# EAGLE design atmega328p robot (EAGLE 8.4.3)
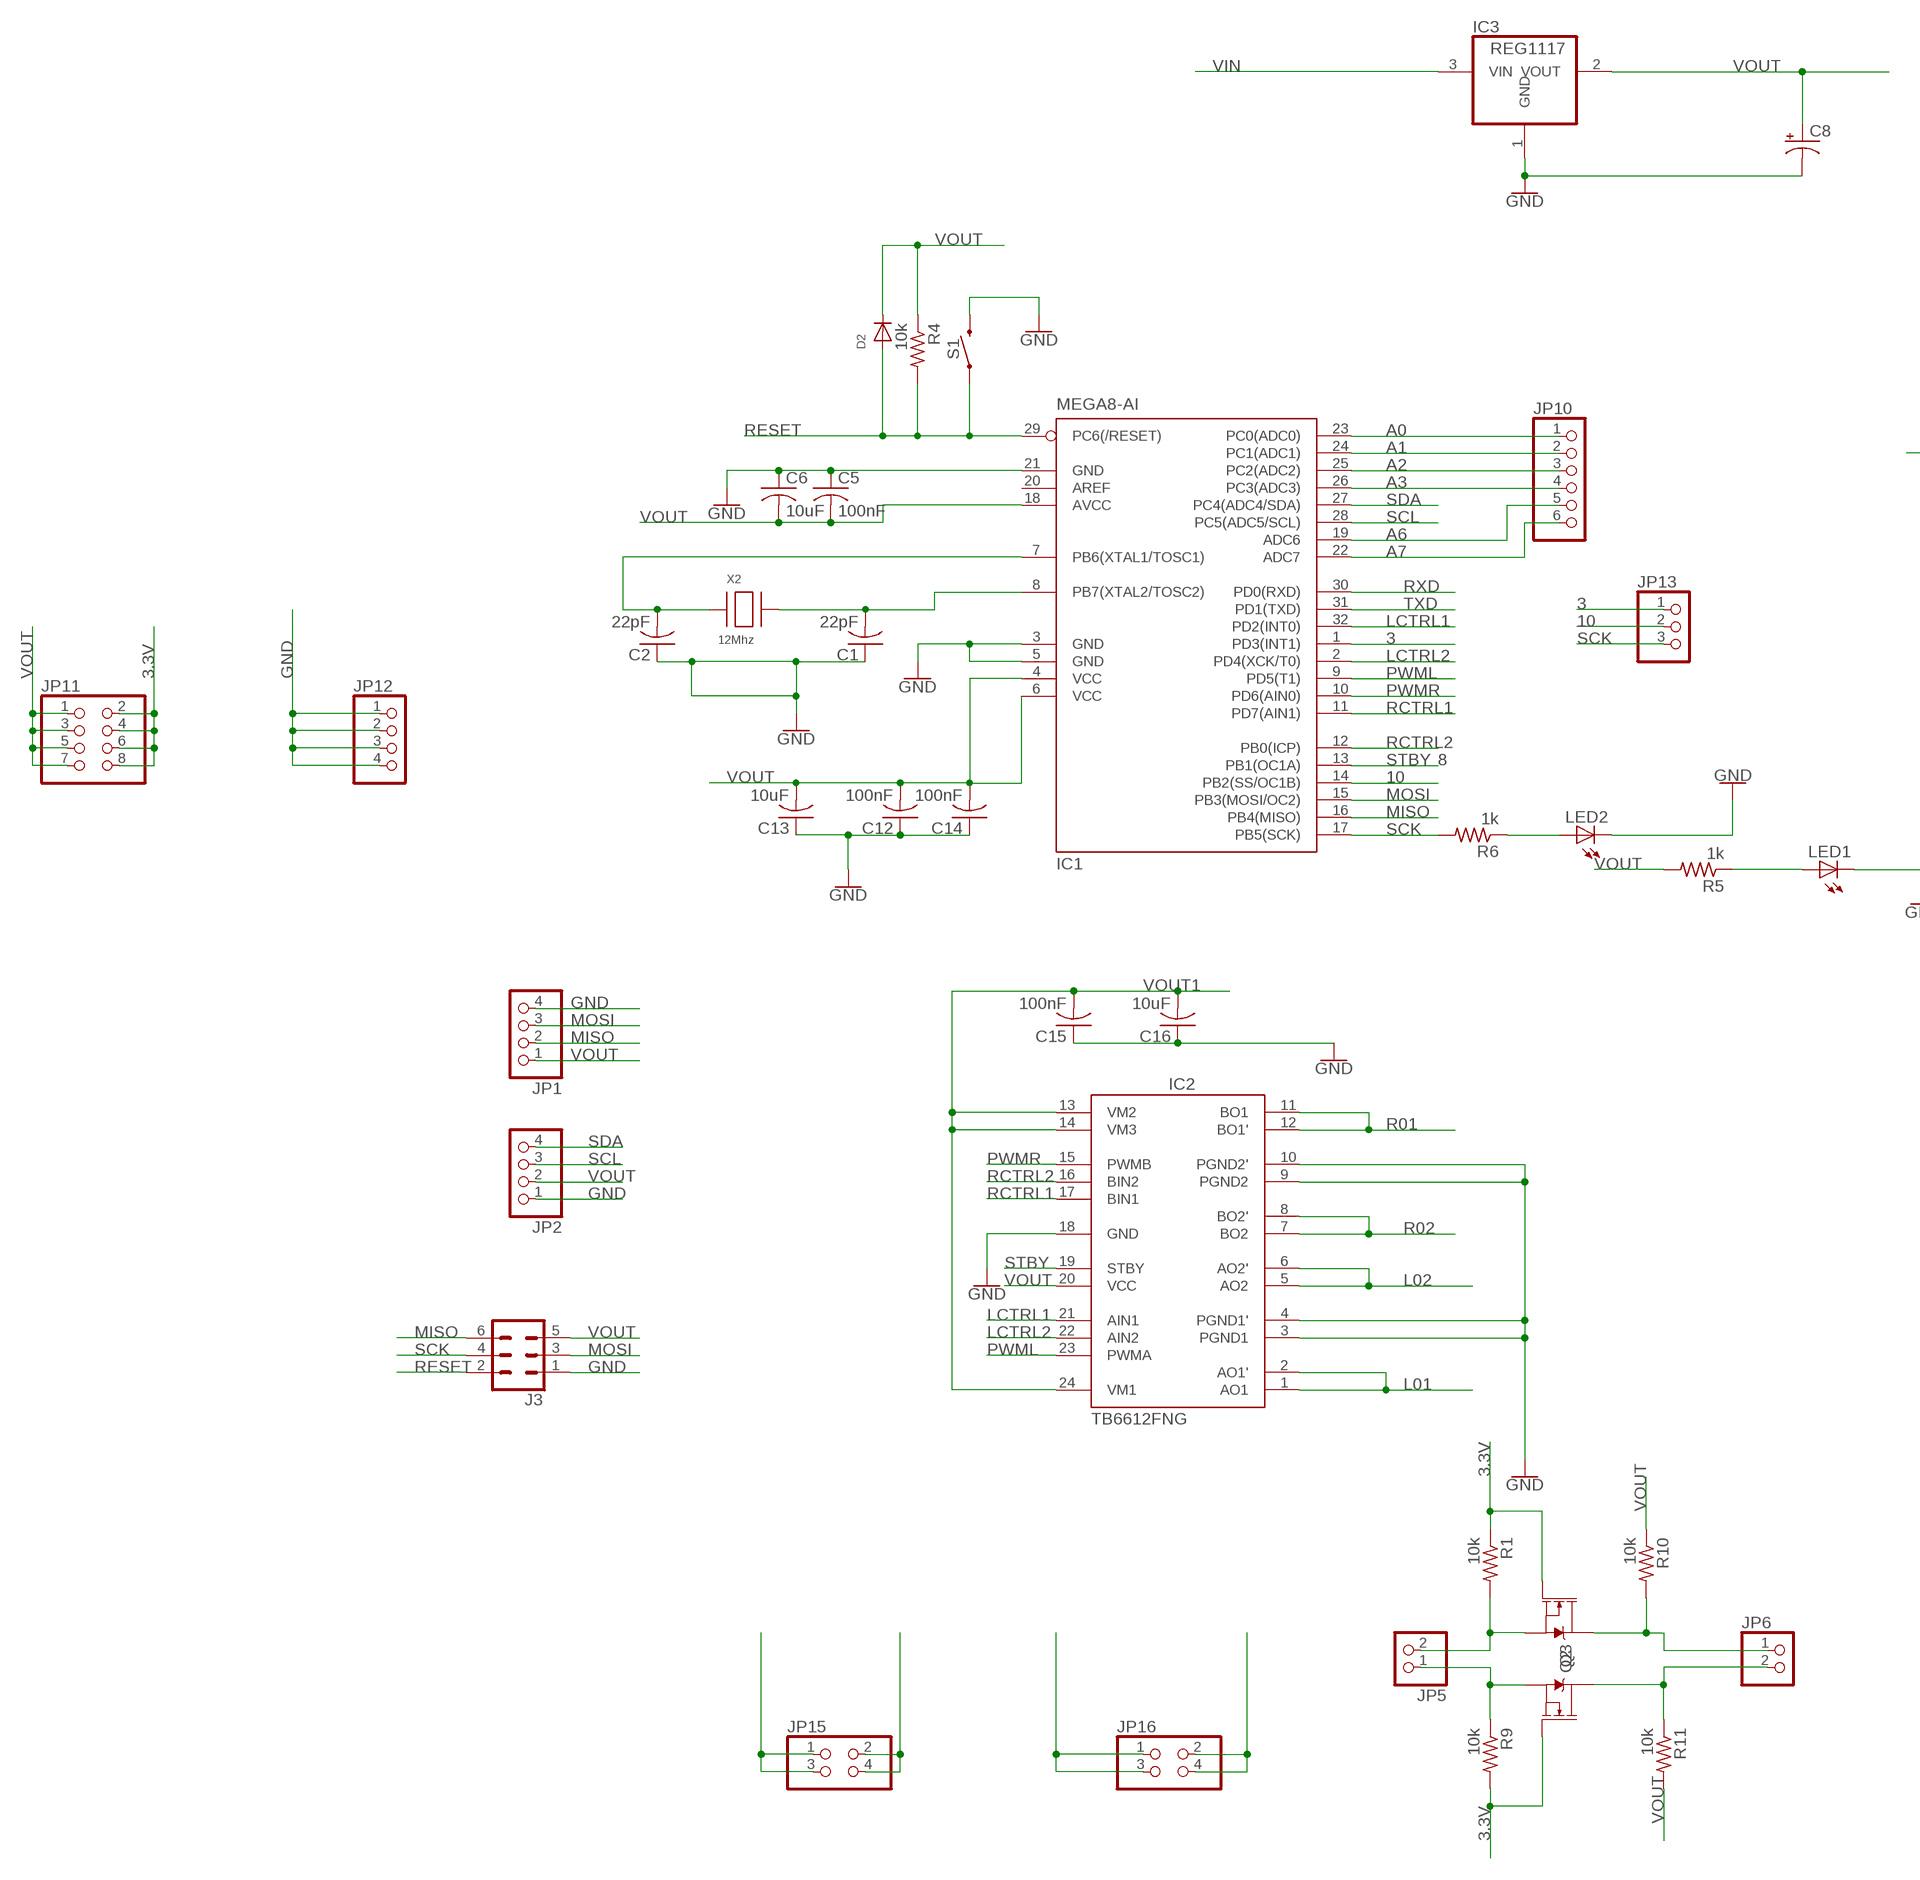
[diagram p0: schematic, sheet 1, part 1 of 2]
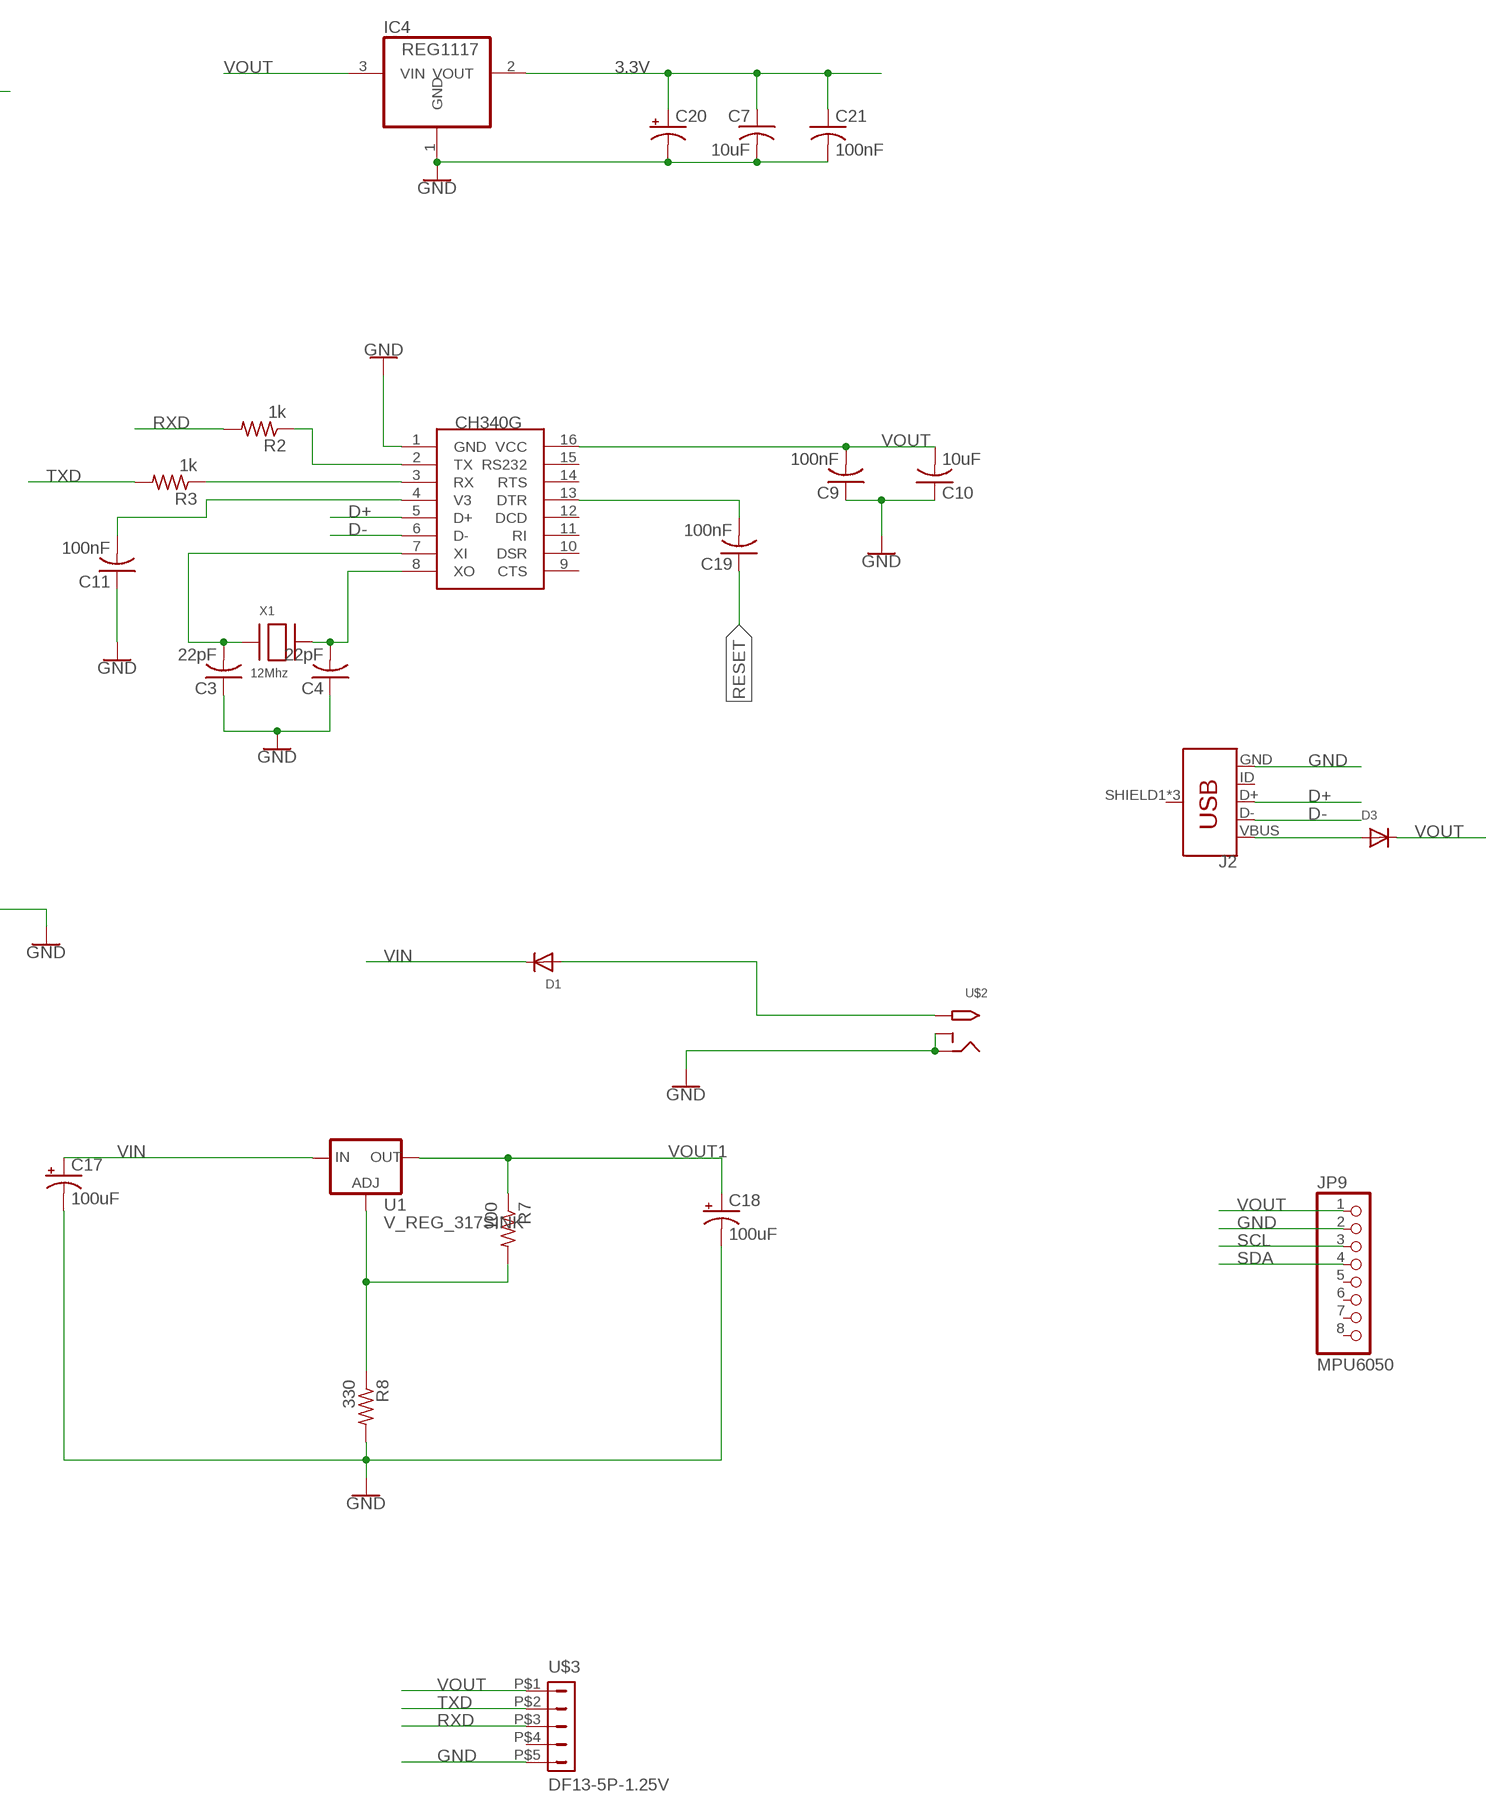
[diagram p1: schematic, sheet 1, part 2 of 2]

## Parts
C1  22pF  C-USC0805  [C0805]
C2  22pF  C-USC0805  [C0805]
C3  22pF  C-USC0805  [C0805]
C4  22pF  C-USC0805  [C0805]
C5  100nF  C-USC0805  [C0805]
C6  10uF  C-USC0805  [C0805]
C7  10uF  C-USC0805  [C0805]
C8  CPOL-USCT7343  [CT7343]
C9  100nF  C-USC0805  [C0805]
C10  10uF  C-USC0805  [C0805]
C11  100nF  C-USC0805  [C0805]
C12  100nF  C-USC0805  [C0805]
C13  10uF  C-USC0805  [C0805]
C14  100nF  C-USC0805  [C0805]
C15  100nF  C-USC0805  [C0805]
C16  10uF  C-USC0805  [C0805]
C17  100uF  CPOL-USCT7343  [CT7343]
C18  100uF  CPOL-USCT7343  [CT7343]
C19  100nF  C-USC0805  [C0805]
C20  CPOL-USCT7343  [CT7343]
C21  100nF  C-USC0805  [C0805]
D1  DIODESOD-123  [SOD-123]
D2  DIODESOD-123  [SOD-123]
D3  DIODESOD-123  [SOD-123]
IC1  MEGA8-AI  [TQFP32-08]
IC2  TB6612FNG  [SSOP24]
IC3  REG1117  [SOT223]
IC4  REG1117  [SOT223]
J2  USB_MICRO-B_FEMALE-SMT  [USB-B-MICRO-SMD]
J3  CONN_03X22X3_SILK_MALE_PTH  [2X3]
JP1  PINHD-1X4  [1X04]
JP2  PINHD-1X4  [1X04]
JP5  PINHD-1X2  [1X02]
JP6  PINHD-1X2  [1X02]
JP9  MPU6050  PINHD-1X8  [1X08]
JP10  PINHD-1X6  [1X06]
JP11  PINHD-2X4  [2X04]
JP12  PINHD-1X4  [1X04]
JP13  PINHD-1X3  [1X03]
JP15  PINHD-2X2  [2X02]
JP16  PINHD-2X2  [2X02]
LED1  LEDCHIP-LED0603  [CHIP-LED0603]
LED2  LEDCHIP-LED0603  [CHIP-LED0603]
Q2  220mA/50V/3.5Ω  MOSFET-NCH-BSS138  [SOT23-3]
Q3  220mA/50V/3.5Ω  MOSFET-NCH-BSS138  [SOT23-3]
R1  10k  R-US_R0805  [R0805]
R2  1k  R-US_R0805  [R0805]
R3  1k  R-US_R0805  [R0805]
R4  10k  R-US_R0805  [R0805]
R5  1k  R-US_R0805  [R0805]
R6  1k  R-US_R0805  [R0805]
R7  100  R-US_R0805  [R0805]
R8  330  R-US_R0805  [R0805]
R9  10k  R-US_R0805  [R0805]
R10  10k  R-US_R0805  [R0805]
R11  10k  R-US_R0805  [R0805]
S1  MOMENTARY-SWITCH-SPST-SMD-6.0X3.5MM  [TACTILE_SWITCH_SMD_6.0X3.5MM]
U1  V_REG_317SINK  [TO220-ADJ]
U$1  CH340G  [SOIC16]
U$2  2.1MMJACKTHM  [PJ-102A]
U$3  DF13-5P-1.25V  [DF13C-5P-1.25V]
X1  12Mhz  XTALNX5032  [NX5032]
X2  12Mhz  XTALNX5032  [NX5032]

## Nets
3: IC1.1(PD3(INT1)) JP13.1
3.3V: C7.1 C20.+ C21.1 IC4.2(VOUT) JP11.2 JP11.4 JP11.6 JP11.8 Q2.1(G) Q3.1(G) R1.1 R9.2
10: IC1.14(PB2(SS/OC1B)) JP13.2
A0: IC1.23(PC0(ADC0)) JP10.1
A1: IC1.24(PC1(ADC1)) JP10.2
A2: IC1.25(PC2(ADC2)) JP10.3
A3: IC1.26(PC3(ADC3)) JP10.4
A6: IC1.19(ADC6) JP10.5
A7: IC1.22(ADC7) JP10.6
D+: J2.D+ U$1.5(D+)
D-: J2.D- U$1.6(D-)
GND: C1.1 C2.1 C3.1 C4.1 C5.1 C6.1 C7.2 C8.- C9.1 C10.1 C11.1 C12.1 C13.1 C14.1 C15.1 C16.1 C17.- C18.- C20.- C21.2 IC1.3(GND) IC1.5(GND) IC1.21(GND) IC2.3(PGND1) IC2.4(PGND1') IC2.9(PGND2) IC2.10(PGND2') IC2.18(GND) IC3.1(GND) IC4.1(GND) J2.GND J3.1 JP1.4 JP2.1 JP9.2 JP12.1 JP12.2 JP12.3 JP12.4 LED1.C LED2.C R8.2 S1.2 U$1.1(GND) U$2.RING U$2.RING_SW U$3.P$5
L01: IC2.1(AO1) IC2.2(AO1') JP16.1 JP16.3
L02: IC2.5(AO2) IC2.6(AO2') JP16.2 JP16.4
LCTRL1: IC1.32(PD2(INT0)) IC2.21(AIN1)
LCTRL2: IC1.2(PD4(XCK/T0)) IC2.22(AIN2)
MISO: IC1.16(PB4(MISO)) J3.6 JP1.2
MOSI: IC1.15(PB3(MOSI/OC2)) J3.3 JP1.3
N$1: C2.2 IC1.7(PB6(XTAL1/TOSC1)) X2.P$1
N$2: C1.2 IC1.8(PB7(XTAL2/TOSC2)) X2.P$2
N$3: C19.2 U$1.13(DTR)
N$4: R2.1 U$1.2(TX)
N$5: C3.2 U$1.7(XI) X1.P$1
N$6: C4.2 U$1.8(XO) X1.P$2
N$7: LED1.A R5.1
N$8: R3.1 U$1.3(RX)
N$9: C11.2 U$1.4(V3)
N$11: LED2.A R6.1
N$13: D1.A U$2.TIP
N$14: R7.2 R8.1 U1.ADJ
N$27: D3.A J2.VBUS
PWML: IC1.9(PD5(T1)) IC2.23(PWMA)
PWMR: IC1.10(PD6(AIN0)) IC2.15(PWMB)
R01: IC2.11(BO1) IC2.12(BO1') JP15.1 JP15.3
R02: IC2.7(BO2) IC2.8(BO2') JP15.2 JP15.4
RCTRL1: IC1.11(PD7(AIN1)) IC2.17(BIN1)
RCTRL2: IC1.12(PB0(ICP)) IC2.16(BIN2)
RESET: C19.1 D2.A IC1.29(PC6(/RESET)) J3.2 R4.2 S1.1
RXD: IC1.30(PD0(RXD)) R2.2 U$3.P$3
SCK: IC1.17(PB5(SCK)) J3.4 JP13.3 R6.2
SCL: IC1.28(PC5(ADC5/SCL)) JP2.3 JP6.2 JP9.3 Q3.3(D) R11.1
SCL3.3: JP5.1 Q3.2(S) R9.1
SDA: IC1.27(PC4(ADC4/SDA)) JP2.4 JP6.1 JP9.4 Q2.3(D) R10.2
SDA3.3: JP5.2 Q2.2(S) R1.2
STBY: IC1.13(PB1(OC1A)) IC2.19(STBY)
TXD: IC1.31(PD1(TXD)) R3.2 U$3.P$2
VIN: C17.+ D1.C IC3.3(VIN) U1.IN
VOUT: C5.2 C6.2 C8.+ C9.2 C10.2 C12.2 C13.2 C14.2 D2.C D3.C IC1.4(VCC) IC1.6(VCC) IC1.18(AVCC) IC2.20(VCC) IC3.2(VOUT) IC4.3(VIN) J3.5 JP1.1 JP2.2 JP9.1 JP11.1 JP11.3 JP11.5 JP11.7 R4.1 R5.2 R10.1 R11.2 U$1.16(VCC) U$3.P$1
VOUT1: C15.2 C16.2 C18.+ IC2.13(VM2) IC2.14(VM3) IC2.24(VM1) R7.1 U1.OUT
Unconnected: IC1.20(AREF) J2.ID J2.SHIELD1(SHIELD) J2.SHIELD2(SHIELD) J2.SHIELD3(SHIELD) JP9.5 JP9.6 JP9.7 JP9.8 U$1.9(CTS) U$1.10(DSR) U$1.11(RI) U$1.12(DCD) U$1.14(RTS) U$1.15(RS232) U$3.P$4

## Notes on the sheet
- 8

## Library data of the parts
C1-C7 C9-C16 C19 C21 = adafruit:C-US: CAPACITOR, American symbol
C8 C17 C18 C20 = adafruit:CPOL-US: POLARIZED CAPACITOR, American symbol
D1-D3 = adafruit:DIODE: Diode SMADIODE - SMA Surface Mount Package 20V 1A Schottky Diode Digikey: 641-1014-6-ND DO-1N4148 - Through Hole Small Current Diode SOD-123 20V 1 A (.5mV Vf) Schottky Diode - Digikey: MBRX120TPMSCT-ND SOD-323 10V 570mA (.38mV Vf, 3ns) Schottky Diode - Digikey: ZLLS410CT-ND SOD-523 30V 30mA Schottky Diode (RB751S-40TE61) - Digikey: RB751S-40TE61CT-ND SOT23-R/W - SOT23 Package (R = Solder Paste/Reflow Ovens, W = Hand-Soldering) BAT54Film 40V 300mA - Digikey: 497-7162-1-ND
IC1 = atmel:MEGA8: MICROCONTROLLER 8 Kbytes FLASH, 1 kbytes SRAM, 512 bytes EEPROM, USART, 6-channel 10 bit ADC, 2-channel 8 bit ADC Pin compatible with Atmega48, ATMega88, ATMega168 Source: avr.lbr; MPN: ATMEGA8-16AU; OC_FARNELL: 9171371; OC_NEWARK: 73M8863
IC2 = adafruit:TB6612FNG: TB6612FNG MOS dual H-bridge motor driver, 1.2A current 3.2A peak 3 or 5v logic and 3-15v motor
IC3 IC4 = burr-brown:REG1117: 800mA and 1A Low Dropout (LDO) Positive Regulator 1.8V, 2.5V, 2.85V, 3.3V, 5V, and Adj; MPN: REG1117; OC_FARNELL: 1097566; OC_NEWARK: 14P6981
J2 = SparkFun-Connectors:USB_MICRO-B: USB Type Micro-B Connector Male/female and PTH/SMT variants SparkFun Products: SparkFun microB USB Breakout <https://www.sparkfun.com/products/12035> SparkFun USB microB Plug Breakout <https://www.sparkfun.com/products/10031> SparkFun ESP8266 Thing <https://www.sparkfun.com/products/13231>; PROD_ID: CONN-11752
J3 = SparkFun-Connectors:CONN_03X2: Multi connection point. Often used as Generic Header-pin footprint for 0.1 inch spaced/style header connections You can populate with any combo of single row headers, but if you'd like an exact match, check these: Header - 2x3 (Male, 0.1") <https://www.sparkfun.com/products/12807> (PRT-12807) Header - 2x3 (Female, 0.1") <https://www.sparkfun.com/products/13010> (PRT-13010) 2x3 Pin Shrouded Header <https://www.sparkfun.com/products/10877> (PRT-10877) On any of the 0.1 inch spaced packages, you can populate with these: Break Away Headers - Straight <https://www.sparkfun.com/products/116> (PRT-00116) Break Away Male Headers - Right Angle <https://www.sparkfun.com/products/553> (PRT-00553) Female Headers <https://www.sparkfun.com/products/115> (PRT-00115) Break Away Headers - Machine Pin <https://www.sparkfun.com/products/117> (PRT-00117) Break Away Female Headers - Swiss Machine Pin <https://www.sparkfun.com/products/743> (PRT-00743) Special note: the shrouded connector mates well with our 3x2 ribbon cables: Ribbon Crimp Connector - 6-pin (2x3, Female) <https://www.sparkfun.com/products/10651> (PRT-10651) Ribbon Cable - 6 wire (15ft) <https://www.sparkfun.com/products/10646> (PRT-10646); PROD_ID: CONN-09701
JP1 JP2 JP12 = pinhead:PINHD-1X4: PIN HEADER
JP5 JP6 = pinhead:PINHD-1X2: PIN HEADER
JP9 = pinhead:PINHD-1X8: PIN HEADER
JP10 = adafruit:PINHD-1X6: PIN HEADER
JP11 = adafruit:PINHD-2X4: PIN HEADER
JP13 = adafruit:PINHD-1X3: PIN HEADER
JP15 JP16 = pinhead:PINHD-2X2: PIN HEADER
LED1 LED2 = adafruit:LED: LED OSRAM: - CHIPLED LG R971, LG N971, LY N971, LG Q971, LY Q971, LO R971, LY R971 LH N974, LH R974 LS Q976, LO Q976, LY Q976 LO Q996 - Hyper CHIPLED LW Q18S LB Q993, LB Q99A, LB R99A - SideLED LS A670, LO A670, LY A670, LG A670, LP A670 LB A673, LV A673, LT A673, LW A673 LH A674 LY A675 LS A676, LA A676, LO A676, LY A676, LW A676 LS A679, LY A679, LG A679 - Hyper Micro SIDELED® LS Y876, LA Y876, LO Y876, LY Y876 LT Y87S - SmartLED LW L88C, LW L88S LB L89C, LB L89S, LG L890 LS L89K, LO L89K, LY L89K LS L896, LA L896, LO L896, LY L896 - TOPLED LS T670, LO T670, LY T670, LG T670, LP T670 LSG T670, LSP T670, LSY T670, LOP T670, LYG T670 LG T671, LOG T671, LSG T671 LB T673, LV T673, LT T673, LW T673 LH T674 LS T676, LA T676, LO T676, LY T676, LB T676, LH T676, LSB T676, LW T676 LB T67C, LV T67C, LT T67C, LS T67K, LO T67K, LY T67K, LW E67C LS E67B, LA E67B, LO E67B, LY E67B, LB E67C, LV E67C, LT E67C LW T67C LS T679, LY T679, LG T679 LS T770, LO T770, LY T770, LG T770, LP T770 LB T773, LV T773, LT T773, LW T773 LH T774 LS E675, LA E675, LY E675, LS T675 LS T776, LA T776, LO T776, LY T776, LB T776 LHGB T686 LT T68C, LB T68C - Hyper Mini TOPLED® LB M676 - Mini TOPLED Santana® LG M470 LS M47K, LO M47K, LY M47K Source: http://www.osram.convergy.de/
Q2 Q3 = SparkFun-DiscreteSemi:MOSFET-NCH: N-channel MOSFETs Voltage controlled devices that allow control of high current outputs. SparkFun Products: SparkFun OpenScale <https://www.sparkfun.com/products/13261> SparkFun Digital Sandbox <https://www.sparkfun.com/products/12651> SparkFun Monster Moto Shield <https://www.sparkfun.com/products/10182> SparkFun MOSFET Power Controller <https://www.sparkfun.com/products/11214>; PROD_ID: TRANS-00830
R1-R11 = adafruit:R-US_: RESISTOR, American symbol
S1 = SparkFun-Switches:MOMENTARY-SWITCH-SPST: Momentary Switch (Pushbutton) - SPST Normally-open (NO) SPST momentary switches (buttons, pushbuttons). Variants PTH-12MM - 12mm square, through-hole Momentary Pushbutton Switch - 12mm Square <https://www.sparkfun.com/products/9190> (COM-09190) PTH-6.0MM, PTH-6.0MM-KIT - 6.0mm square, through-hole Mini Pushbutton Switch <https://www.sparkfun.com/products/97> (COM-00097) KIT package intended for soldering kit's - only one side of pads' copper is exposed. PTH-RIGHT-ANGLE-KIT - Right-angle, through-hole Right Angle Tactile Button <https://www.sparkfun.com/products/10791> - Used on SparkFun BigTime Watch Kit <https://www.sparkfun.com/products/11734> SMD-12MM - 12mm square, surface-mount Tactile Button - SMD (12mm) <https://www.sparkfun.com/products/12993> (COM-12993) Used on SparkFun PicoBoard <https://www.sparkfun.com/products/11888> SMD-4.5MM - 4.5mm Square Trackball Switch Used on SparkFun Blackberry Trackballer Breakout <https://www.sparkfun.com/products/13169> SMD-4.6MMX2.8MM - 4.60mm x 2.80mm, surface mount Used on SparkFun SAMD21 Mini Breakout <https://www.sparkfun.com/products/13664> SMD-5.2MM, SMD-5.2-REDUNDANT - 5.2mm square, surface-mount Mini Pushbutton Switch - SMD <https://www.sparkfun.com/products/8720> (COM-08720) Used on Arduino Pro Mini <https://www.sparkfun.com/products/11114> REDUNDANT package connects both switch circuits together SMD-6.0X3.5MM - 6.0 x 3.5mm, surface mount Momentary Reset Switch SMD <https://www.sparkfun.com/products/8229> (COM-08229) SMD-6.2MM-TALL - 6.2mm square, surface mount Tactile Button - SMD (6mm) <https://www.sparkfun.com/products/12992> Used on SparkFun Digital Sandbox <https://www.sparkfun.com/products/12651> SMD-RIGHT-ANGLE - Right-angle, surface mount Used on SparkFun Block for Intel® Edison - Arduino <https://www.sparkfun.com/products/13036>; PROD_ID: SWCH-00815; SF_SKU: COM-08229
U1 = SparkFun-IC-Power:V_REG_317: Voltage Regulator Standard LM317 adjustable voltage regulator. AOI (Adjust Output Input). Google 'LM317 Calculator' for easy to use app to get the two resistor values needed. 240/720 for 5V output. 240/390 for 3.3V output. Spark Fun Electronics SKU : COM-00527
U$1 = ch340g:CH340G
U$2 = adafruit:2.1MMJACK: 2.1mm x 5.5mm THM DC jack with internal switch. Digikey part #PJ-102A, 4UCON part #05537 2.1mm x 5.5mm SMT DC jack with internal switch. Digikey part #PJ-002A-SMT, 4UCON part #03267 By microbuilder.eu & adafruit.com
U$3 = con-hirose-df13:DF13-5P-1.25: DF13-5P 1.25mm Pitch Miniature Crimping Connector.
X1 X2 = adafruit:XTAL: Low cost SMT crystals, no capacitors included http://www.ladyada.net/library/eagle

## Board
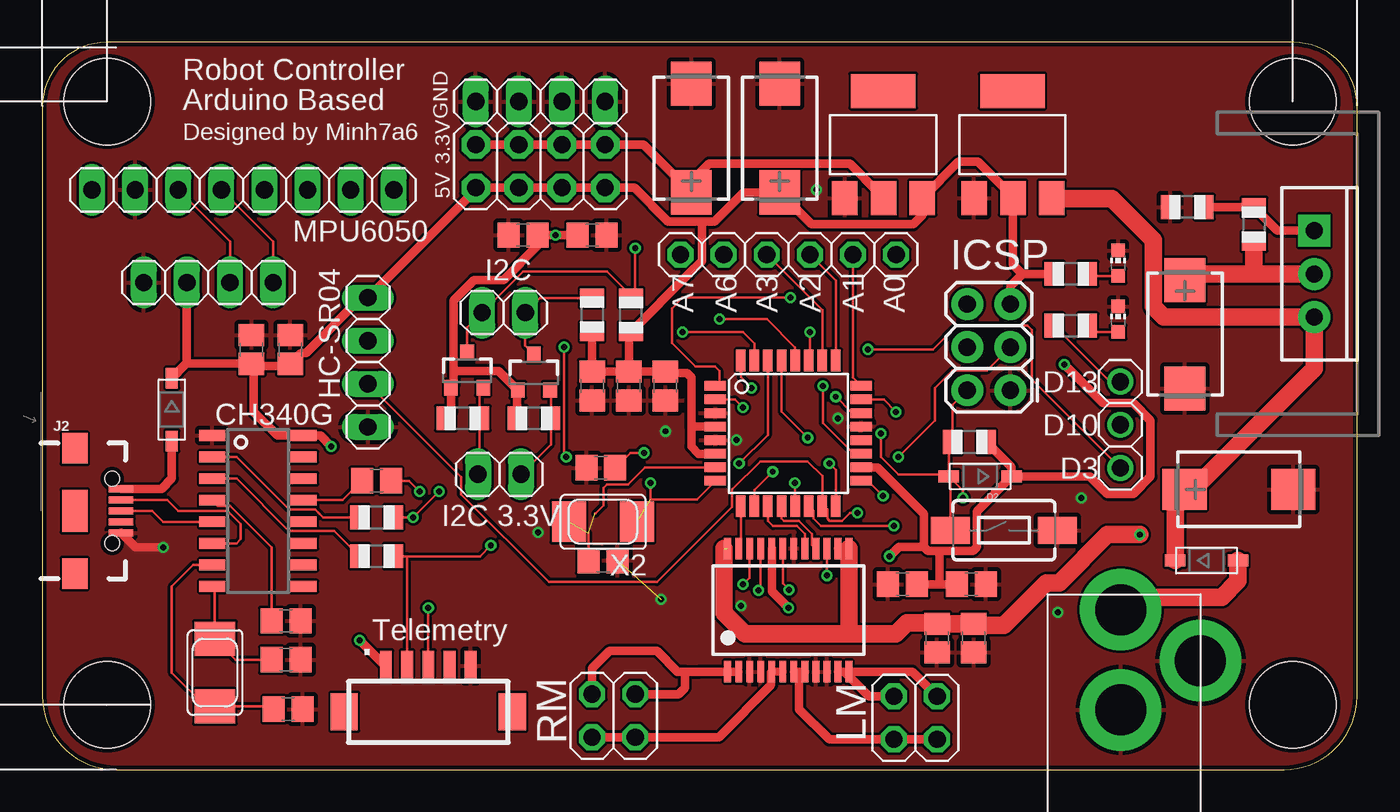
[diagram p2: board, top side]
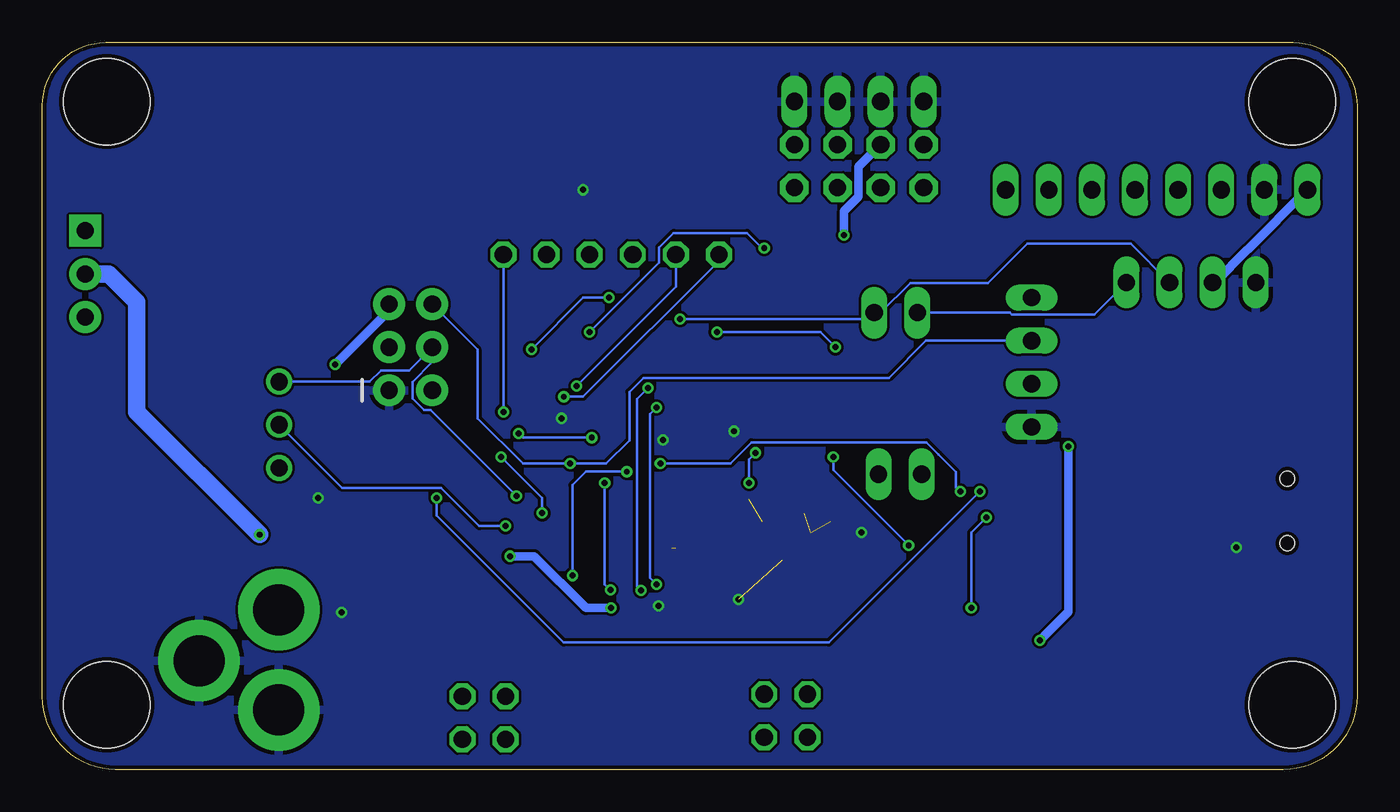
[diagram p3: board, bottom side, seen from below]

Size 77.45 x 42.85 mm. Coordinates in mm from the lower left corner, seen from the top.
Outline: 0,39.09 0,4.34 arc90 4.34,0 73.15,0 arc90 77.45,4.3 77.45,39.13 arc90 73.73,42.85 3.75,42.85 arc90 0,39.09
Copper layers (1*16): Top 0.035mm / dielectric 1.5mm / Bottom 0.035mm
Design rules "SeeedStudio_2layer_DRU_no_angle_20140221": minimum track width 6mil, minimum drill 12mil, track to track 6mil, track to pad 6mil, pad to pad 6mil, via to via 6mil, smd to smd 0mil, copper to edge 10mil, drill to drill 10mil, minimum pad ring 10mil, minimum via ring 6mil, stop-mask expansion 2mil, vias tented up to drill 100mil, thermal gap 10mil
Holes 5.08 mm at 3.81,39.37 3.81,3.81 73.66,3.81 73.66,39.37

### Footprints (pad centres in the part's own frame; a part is rotated, then mirrored left to right if it is on the bottom)
C0805 = smd 1.3 x 1.5: 1 -0.85,0; 2 0.85,0
CT7343 = smd 2.6 x 2.4: + 3.2,0; - -3.2,0
SOD-123 = smd 1.2 x 0.7: A 1.85,0; C -1.85,0
TQFP32-08 = smd 1.27 x 0.559: 1 -4.293,2.8; 2 -4.293,2; 3 -4.293,1.2; 4 -4.293,0.4; 5 -4.293,-0.4; 6 -4.293,-1.2; 7 -4.293,-2; 8 -4.293,-2.8; 17 4.293,-2.8; 18 4.293,-2; 19 4.293,-1.2; 20 4.293,-0.4; 21 4.293,0.4; 22 4.293,1.2; 23 4.293,2; 24 4.293,2.8 | smd 0.559 x 1.27: 9 -2.8,-4.293; 10 -2,-4.293; 11 -1.2,-4.293; 12 -0.4,-4.293; 13 0.4,-4.293; 14 1.2,-4.293; 15 2,-4.293; 16 2.8,-4.293; 25 2.8,4.293; 26 2,4.293; 27 1.2,4.293; 28 0.4,4.293; 29 -0.4,4.293; 30 -1.2,4.293; 31 -2,4.293; 32 -2.8,4.293
SSOP24 = smd 0.4 x 1.25: 1 -3.575,-3.625; 2 -2.925,-3.625; 3 -2.275,-3.625; 4 -1.625,-3.625; 5 -0.975,-3.625; 6 -0.325,-3.625; 7 0.325,-3.625; 8 0.975,-3.625; 9 1.625,-3.625; 10 2.275,-3.625; 11 2.925,-3.625; 12 3.575,-3.625; 13 3.575,3.625; 14 2.925,3.625; 15 2.275,3.625; 16 1.625,3.625; 17 0.975,3.625; 18 0.325,3.625; 19 -0.325,3.625; 20 -0.975,3.625; 21 -1.625,3.625; 22 -2.275,3.625; 23 -2.925,3.625; 24 -3.575,3.625
SOT223 = smd 1.499 x 2.007: 1 -2.261,-3.15; 2 0.025,-3.15; 3 2.311,-3.15 | smd 3.81 x 2.007: 4 0,3.15
USB-B-MICRO-SMD = smd 1.45 x 0.4: D+ 2.725,0; D- 2.725,0.65; GND 2.725,-1.3; ID 2.725,-0.65; VBUS 2.725,1.3 | smd 1.5 x 1.8: SHIELD1 0,3.685; SHIELD2 0,-3.685 | smd 1.5 x 2.5: SHIELD3 0,0 | hole 0.85: 2.2,1.9; 2.2,-1.9
2X3 = drill 1.016 pad 1.88: 1 0,0; 2 0,2.54; 3 2.54,0; 4 2.54,2.54; 5 5.08,0; 6 5.08,2.54
1X04 = drill 1.016 long: 1 -3.81,0; 2 -1.27,0; 3 1.27,0; 4 3.81,0
1X02 = drill 1.016 long: 1 -1.27,0; 2 1.27,0
1X08 = drill 1.016 long: 1 -8.89,0; 2 -6.35,0; 3 -3.81,0; 4 -1.27,0; 5 1.27,0; 6 3.81,0; 7 6.35,0; 8 8.89,0
1X06 = drill 1.016 octagon: 1 -6.35,0; 2 -3.81,0; 3 -1.27,0; 4 1.27,0; 5 3.81,0; 6 6.35,0
2X04 = drill 1.016 pad 1.676 octagon: 1 -3.81,-1.27; 2 -3.81,1.27; 3 -1.27,-1.27; 4 -1.27,1.27; 5 1.27,-1.27; 6 1.27,1.27; 7 3.81,-1.27; 8 3.81,1.27
1X03 = drill 1.016: 1 -2.54,0; 2 0,0; 3 2.54,0
2X02 = drill 1.016 octagon: 1 -1.27,-1.27; 2 -1.27,1.27; 3 1.27,-1.27; 4 1.27,1.27
CHIP-LED0603 = smd 0.8 x 0.8: A 0,-0.75; C 0,0.75
SOT23-3 = smd 0.8 x 0.9: 1 -0.95,-1; 2 0.95,-1; 3 0,1.1
R0805 = smd 1.1 x 1.4: 1 -1,0; 2 1,0
TACTILE_SWITCH_SMD_6.0X3.5MM = smd 2.3 x 1.6: 1 -3.15,0; 2 3.15,0
TO220-ADJ = drill 1 pad 1.88 square: ADJ -2.54,0 | drill 1 pad 1.88: IN 2.54,0; OUT 0,0
SOIC16 = smd 0.635 x 1.524: 1 -4.445,-2.695; 2 -3.175,-2.695; 3 -1.905,-2.695; 4 -0.635,-2.695; 5 0.635,-2.695; 6 1.905,-2.695; 7 3.175,-2.695; 8 4.445,-2.695; 9 4.445,2.695; 10 3.175,2.695; 11 1.905,2.695; 12 0.635,2.695; 13 -0.635,2.695; 14 -1.905,2.695; 15 -3.175,2.695; 16 -4.445,2.695
PJ-102A = drill 3 pad 4.8: RING 0.1,-3.39; RING_SW -4.6,-6.29; TIP 0.1,-9.29
DF13C-5P-1.25V = smd 1.6 x 2.2: M$0 4.95,-1.8; M$1 -4.95,-1.8 | smd 0.7 x 1.8: P$1 -2.5,0.9; P$2 -1.25,0.9; P$3 0,0.9; P$4 1.25,0.9; P$5 2.5,0.9
NX5032 = smd 2 x 2.4: P$1 2,0; P$2 -2,0

### Placement (x,y rotation side)
C1  32.89,17.78 0 top
C2  33.02,12.32 180 top
C3  14.48,3.56 180 top
C4  14.35,6.48 180 top
C5  14.61,24.77 270 top
C6  32.38,22.61 90 top
C7  32.38,31.5 0 top
C8  43.43,37.21 270 top
C9  50.67,10.92 0 top
C10  54.74,10.92 180 top
C11  14.35,8.76 180 top
C12  34.54,22.61 90 top
C13  12.32,24.77 270 top
C14  36.7,22.61 90 top
C15  52.7,7.75 90 top
C16  54.86,7.75 90 top
C17  70.48,16.51 180 top
C18  67.31,25.65 90 top
C19  19.68,17.02 180 top
C20  38.23,37.21 270 top
C21  28.32,31.5 180 top
D1  68.58,12.32 0 top
D2  55.24,17.27 180 top
D3  7.62,21.21 270 top
IC1  43.94,19.81 0 top
IC2  43.94,9.4 0 top
IC3  57.15,36.83 0 top
IC4  49.53,36.83 0 top
J2  1.91,15.24 0 top
J3  57.02,22.35 90 top
JP1  19.18,24 270 top
JP2  9.78,28.7 0 top
JP5  26.92,17.4 180 top
JP6  27.18,26.92 0 top
JP9  11.81,34.16 0 top
JP10  43.94,30.35 180 top
JP11  29.34,35.56 0 top
JP12  29.34,39.37 0 top
JP13  63.5,20.32 90 top
JP15  51.44,3.05 180 top
JP16  33.66,3.17 180 top
LED1  63.37,29.84 0 top
LED2  63.37,26.54 0 top
Q2  25.02,23.5 0 top
Q3  28.96,23.37 0 top
R1  24.77,20.7 0 top
R2  19.68,14.86 0 top
R3  19.68,12.57 0 top
R4  54.61,19.3 180 top
R5  60.58,29.21 180 top
R6  60.58,26.16 180 top
R7  71.37,32.13 90 top
R8  67.44,33.15 180 top
R9  28.96,20.7 180 top
R10  34.67,26.8 90 top
R11  32.38,26.8 270 top
S1  56.64,14.1 0 top
U1  74.93,29.21 270 top
U$1  12.7,15.24 270 top
U$2  63.63,0.13 180 top
U$3  22.73,5.21 0 top
X1  10.16,5.71 270 top
X2  33.02,14.61 180 top

### Tracks (layer width: path | path; a pad name or v marks a point on that pad's centre or on a via)
3  (via drill 0.35)
  Top 0.152: JP13.1 58.29,22.99 58.29,25.91 58.04,26.16 53.85,26.16 52.45,24.77 v48.64,24.77 | IC1.1 39.88,22.84 39.88,23.5 39.62,23.75 38.48,23.75 37.08,25.15 37.08,27.18 37.72,27.81 v44.07,27.81
  Bottom 0.152: v48.64,24.77 45.59,27.81 v44.07,27.81
3.3V  (via drill 0.35)
  Top 0.508: IC4.2 48.42,34.81 48.42,34.85 47.56,35.72 39.27,35.72 38.23,34.67 C20.+ 35.41,36.83 JP11.8 JP11.6 JP11.4 JP11.2 | R9.2 27.96,22.32 Q3.1 26.88,23.5 24.21,23.5 | R1.1 24.07,21 Q2.1 24.21,22.64 24.21,23.5 | C7.1 v30.23,31.5 C21.1 29.17,30.87 27.16,28.85 25.42,28.85 24.21,27.64 24.21,23.5
  Bottom 0.508: v30.23,31.5 30.23,32.91 29.36,33.77 29.36,35.53 JP11.4
10  (via drill 0.35)
  Top 0.152: IC1.14 45.43,15.23 45.43,14.79 45.87,14.35 v50.16,14.35
  Bottom 0.152: v50.16,14.35 51.72,14.35 53.98,16.61 59.79,16.61 JP13.2
A0  (via drill 0.35)
  Top 0.152: IC1.23 49.56,21.81 v50.29,21.08
  Bottom 0.152: v50.29,21.08 JP10.1
A1
  Top 0.152: IC1.24 47.75,23.09 JP10.2
A2
  Top 0.152: IC1.25 46.74,28.82 JP10.3
A3
  Top 0.152: IC1.26 45.94,27.08 JP10.4
A6  (via drill 0.35)
  Top 0.152: v45.97,22.61 45.97,20.43 47.8,18.61 IC1.19
  Bottom 0.152: v45.97,22.61 40.13,28.45 JP10.5
A7  (via drill 0.35)
  Top 0.152: 48.18,20.95 IC1.22 47.7,21.01 v46.74,21.97
  Bottom 0.152: JP10.6 37.59,29.97 45.59,21.97 v46.74,21.97
D+
  Top 0.152: U$1.5 7.11,14.61 6.48,15.24 J2.D+
D-
  Top 0.152: J2.D- 7.35,15.89 8,15.24 10.92,15.24 11.68,14.48 11.68,13.59 11.43,13.34 U$1.6
GND  (via drill 0.35)  (1 unrouted)
  Top 0.508: J2.GND 5.49,13.08 v7.11,13.08
  other vias: 40.89,19.43 46.86,20.7 41.15,9.65 61.21,16 59.82,9.27 45.59,34.16 29.21,13.97 36.45,10.03 36.7,19.94
  pour Top: -1.65,-0.38 -1.65,43.43 -1.52,43.56 79.76,43.56 79.88,43.43 79.88,-2.16 80.01,-2.29 0.13,-2.29 -1.65,-0.51
  pour Bottom: -1.27,-7.62 -1.27,44.45 81.28,44.45 81.28,-3.81 81.28,-7.62
L01
  Top 0.508: IC2.2 IC2.1 38.73,5.77 37.85,5.77 | 37.41,5.77 37.4,5.77 | 37.85,5.77 37.41,5.77 | 37.41,5.77 36.2,6.99 33.4,6.99 32.38,5.97 JP16.3 | JP16.1 37.47,4.45 37.85,4.83 37.85,5.77
L02
  Top 0.457: IC2.6 IC2.5
  Top 0.508: IC2.5 42.92,5.73 42.92,4.98 39.85,1.91 JP16.2 JP16.4
LCTRL1  (via drill 0.35)
  Top 0.152: IC1.32 41.14,23.12 v41.78,22.48 | IC2.21 42.32,10.7 v42.18,10.56
  Bottom 0.152: v42.18,10.56 42.42,10.8 42.42,21.84 v41.78,22.48
LCTRL2  (via drill 0.35)
  Top 0.152: IC1.2 40.8,21.81 v41.27,21.34 | v41.27,10.92 41.66,11.3 41.66,13.01 IC2.22
  Bottom 0.152: v41.27,21.34 41.66,20.95 41.66,11.3 v41.27,10.92
MISO  (via drill 0.35)
  Top 0.152: v46.35,18.03 46.74,17.65 IC1.16
  Bottom 0.152: JP1.2 25.4,25.27 27.58,23.09 42.03,23.09 42.87,22.25 42.87,19.4 44.24,18.03 v46.35,18.03 49.15,18.03 51.82,20.7 51.82,24.77 J3.6
MOSI  (via drill 0.35)
  Top 0.152: J3.3 55.65,23.52 53.62,23.52 52.58,22.48 52.58,20.57 v50.42,18.41 | 45.97,15.49 IC1.15 45.94,15.62 | 45.94,15.62 45.94,17.3 45.09,18.16 42.29,18.16 40.63,16.5 40.63,15.49 36.2,11.05 29.84,11.05 24.66,16.23 24.66,17.25 JP1.3 | 45.94,15.62 46.23,15.33 46.23,14.79 46.37,14.66 47.12,14.66 47.57,15.11 v48.01,15.11
  Bottom 0.152: v50.42,18.41 48.01,16 v48.01,15.11
N$1  (2 unrouted)
  Top 0.152: 32.56,15.08 32.59,15.08 33.06,15.56 33.06,16.61 33.26,16.8 34.49,16.8 35.5,17.81 IC1.7 | C2.2 32.17,13.94
N$2  (via drill 0.35)  (1 unrouted)
  Top 0.152: IC1.8 38.55,15.91 35.81,15.91 v35.81,16.89 | v35.43,18.67 34.63,18.67 C1.2
  Bottom 0.152: v35.81,16.89 35.81,18.29 v35.43,18.67
N$3
  Top 0.152: U$1.13 17.69,15.88 C19.2
N$4
  Top 0.152: R2.1 16.54,14.86 16.34,15.07 | 16.34,15.07 16.25,15.15 | 10.16,18.41 10.29,18.41 | 10.16,18.41 U$1.2 | 16.34,15.07 16.07,15.33 14.54,15.33 11.45,18.41 10.16,18.41
N$5
  Top 0.152: C3.2 13.47,3.71 X1.P$1 9.62,3.71 7.62,5.71 7.62,10.79 8.89,12.06 U$1.7
N$6
  Top 0.152: C4.2 11.4,6.48 X1.P$2 10.16,10.64 U$1.8
N$7
  Top 0.152: R5.1 61.69,29.09 LED1.A
N$8
  Top 0.152: 10.41,17.14 U$1.3 11.43,17.14 14.52,14.06 14.61,14.06 | R3.1 17.2,14.06 14.61,14.06 | 14.61,14.06 14.54,14.06
N$9
  Top 0.152: U$1.4 10.34,15.54 11.05,15.54 13.5,13.09 C11.2
N$11
  Top 0.152: R6.1 61.95,25.79 LED2.A
N$13
  Top 1.016: U$2.TIP 64.27,10.16 69.47,10.16 70.43,11.12 D1.A
N$14
  Top 0.508: R8.1 68.45,33.13 R7.2 72.75,31.75 U1.ADJ
N$27
  Top 0.508: J2.VBUS 7.01,16.54 7.62,17.14 D3.A
PWML
  Top 0.152: IC1.9 41.14,13.15 IC2.23
PWMR  (via drill 0.35)
  Top 0.152: IC1.10 41.94,16.47 v43.02,17.55 | v46.23,11.43 46.22,11.44 IC2.15
  Bottom 0.152: v43.02,17.55 45.44,17.55 46.23,16.76 v46.23,11.43
R01
  Top 0.508: 47.24,5.77 IC2.12 51.25,5.77 JP15.1 | 47.24,5.77 IC2.11 | JP15.3 48.7,4.32 47.24,5.77
R02
  Top 0.508: IC2.7 44.58,5.77 | 44.58,5.77 IC2.8 | 44.58,5.77 44.58,3.56 46.35,1.78 JP15.4 JP15.2
RCTRL1
  Top 0.152: IC2.17 44.92,13.88 44.45,14.35 43.05,14.35 42.74,14.66 IC1.11
RCTRL2
  Top 0.152: IC2.16 45.35,13.24 45.35,13.89 44.58,14.66 43.69,14.66 43.54,14.8 IC1.12
RESET  (via drill 0.35)
  Top 0.152: S1.1 53.49,17.18 D2.A | 53.4,17.4 D2.A | 53.4,17.4 53.4,19.09 R4.2 53.61,21.48 J3.2 | IC1.29 43.54,21.1 v45.09,19.56 | v49.4,19.81 49.4,18.41 50.42,17.4 53.4,17.4 | C19.1 21.59,17.02 v22.23,16.38 | v54.23,16 54.23,16.44 D2.A
  Bottom 0.152: v45.09,19.56 49.15,19.56 v49.4,19.81 | v22.23,16.38 31.11,7.49 46.74,7.49 54.23,14.99 v54.23,16
RXD  (via drill 0.35)
  Top 0.152: R2.2 v21.84,14.86 v23.37,16.38 | v41.05,18.03 42.74,19.73 IC1.30 | U$3.P$3 v22.73,9.53
  Bottom 0.152: v23.37,16.38 23.62,16.64 23.62,17.53 24.66,18.57 25.37,19.28 35.68,19.28 36.93,18.03 v41.05,18.03 | v22.73,9.53 22.73,13.97 v21.84,14.86
SCK  (via drill 0.35)
  Top 0.152: JP13.3 62.88,22.86 R6.2 | IC1.17 48.65,17.01 v49.53,16.13
  Bottom 0.152: JP13.3 58.17,22.86 57.51,23.52 55.85,23.52 J3.4 54.48,24 55.65,22.84 55.65,21.87 54.97,21.18 54.59,21.18 v49.53,16.13
SCL  (via drill 0.35)
  Top 0.152: Q3.3 28.45,24.98 JP6.2 29.32,27.8 R11.1 | v39.88,26.54 42.67,26.54 44.34,24.87 IC1.28 | JP2.3 11.05,31.11 JP9.3
  Bottom 0.152: v39.88,26.54 28.83,26.54 JP6.2 28.07,26.92 26.32,28.68 21.74,28.68 19.43,30.99 13.34,30.99 JP2.3
SCL3.3
  Top 0.152: Q3.2 29.96,22.32 R9.1 29.96,19.16 JP5.1
SDA  (via drill 0.35)
  Top 0.152: Q2.3 25.02,26.04 JP6.1 28.32,29.34 33.27,29.34 34.67,27.94 R10.2 34.92,28.05 v34.92,30.73 | v45.21,25.78 45.21,24.18 IC1.27 | JP2.4 13.59,31.11 JP9.4
  Bottom 0.152: v45.21,25.78 41.12,29.87 41.12,30.76 40.26,31.62 35.94,31.62 35.05,30.73 v34.92,30.73 | JP6.1 20.45,26.92 20.35,26.82 15.47,26.82 JP2.4
SDA3.3
  Top 0.152: Q2.2 25.77,22.29 R1.2 25.77,17.51 JP5.2
STBY  (via drill 0.35)
  Top 0.152: IC1.13 44.34,16.87 v44.32,16.89 | v43.99,10.59 43.62,10.96 IC2.19
  Bottom 0.152: v43.99,10.59 44.32,10.92 v44.32,16.89
TXD  (via drill 0.35)
  Top 0.152: 21.46,12.57 R3.2 | 21.46,12.57 25.78,12.57 v26.42,13.21 | v30.73,24.89 30.73,21.5 30.73,18.54 v30.86,18.41 | IC1.31 41.94,25.11 41.27,25.78 v37.72,25.78 | U$3.P$2 21.48,12.55 21.46,12.57
  Bottom 0.152: v26.42,13.21 30.86,17.65 v30.86,18.41 | v37.72,25.78 31.62,25.78 v30.73,24.89
VIN
  Top 1.016: D1.C 66.73,15.96 C17.+ 67.82,16.51 74.93,23.62 U1.IN 66.06,26.67 65.45,27.28 65.45,31.2 62.99,33.66 59.49,33.66 IC3.3
VOUT  (via drill 0.35)
  Top 0.508: 25.65,34.29 JP11.3 JP11.5 JP11.7 34.87,34.29 36.86,32.3 38.86,32.3 | 25.65,34.29 JP11.1 | 38.86,32.3 39.59,32.3 41.3,34.01 C8.+ 45.31,32.13 51.31,32.13 51.84,32.66 IC4.3 53.98,35.81 55.12,35.81 57.17,33.76 IC3.2 57.17,29.77 57.73,29.21 | C12.2 C14.2 36.79,23.37 37.97,23.37 38.23,23.11 38.23,20.19 | 38.23,20.19 38.23,19.05 38.66,18.61 IC1.6 | R11.2 C6.2 C12.2 | C12.2 34.54,25.67 R10.1 38.06,29.18 38.08,29.18 38.86,29.97 38.86,32.3 | J3.5 57.02,28.5 57.73,29.21 | 57.73,29.21 R5.2 | D2.C 57.09,17.82 R4.1 | 51.94,13.13 51.94,15.06 49.19,17.81 IC1.18 | 51.94,13.13 52.17,12.89 52.7,12.89 | 52.7,12.89 54.81,12.89 55.05,13.13 55.05,15.22 D2.C | 51.94,13.13 50.47,13.13 v49.91,12.57 | D2.C 61.72,17.27 62.74,16.26 64.26,16.26 65.28,17.27 65.28,20.57 64.26,21.59 62.48,21.59 v60.2,23.88 | v17.02,19.05 16.38,19.68 U$1.16 13.84,19.68 12.45,21.08 12.45,23.79 | 12.45,23.79 C13.2 8.48,23.91 | 12.45,23.79 14.48,23.79 C5.2 15.25,24.56 15.52,24.56 18.78,27.81 JP1.1 25.65,34.29 | 8.48,23.91 D3.C | IC2.20 42.97,10.89 42.97,10.5 v43.94,9.53 | C9.2 52.83,10.92 | 52.83,10.92 C10.2 | 52.83,10.92 52.83,12.76 52.7,12.89 | 38.23,20.19 38.25,20.21 IC1.4 | JP2.2 8.51,23.95 8.48,23.91 | v18.68,7.62 20.2,6.11 U$3.P$1
  Bottom 0.508: v49.91,12.57 48.48,12.57 45.43,9.53 v43.94,9.53 | v60.2,23.88 57.02,27.05 J3.5 | v17.02,19.05 17.02,9.29 v18.68,7.62 | JP9.1 6.45,30.63 8.38,28.7 JP2.2
VOUT1  (via drill 0.35)  (1 unrouted)
  Top 0.508: IC2.13 IC2.14
  Top 1.016: 71.5,29.21 U1.OUT | 71.5,29.21 67.67,29.21 C18.+ | R7.1 71.37,29.34 71.5,29.21 | C15.2 C16.2 54.95,8.51 56.64,8.51 59.14,11.01 59.91,11.01 62.74,13.84 v64.64,13.84 | C15.2 52.67,8.64 | 40.16,13.02 40.16,9.25 41.4,8 47.37,8 | IC2.13 47.52,8.15 47.37,8 | C15.2 52.67,8.64 | 52.67,8.64 50.93,8.64 50.29,8 47.37,8
  Bottom 1.016: v64.64,13.84 71.88,21.08 71.88,27.56 73.53,29.21 U1.OUT

### Text on the board
tPlace: Robot Controller | Arduino Based | GND | Designed by Minh7a6 | 3.3V | 5V | I2C | ICSP | A7 | A6 | A3 | A2 | A1 | A0 | HC-SR04 | D13 | D10 | D3 | I2C 3.3V | Telemetry | RM | LM
tValues: OLED